# Altium schematic sheet Thermometer.SchDoc
size A4
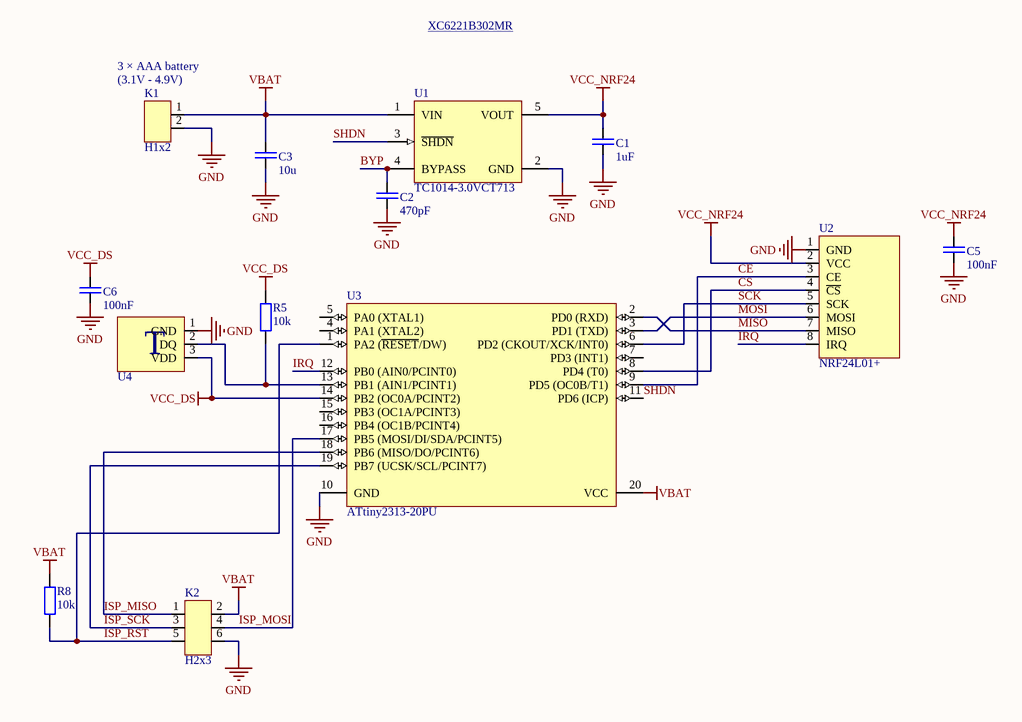
[diagram p0: Thermometer.SchDoc]

## Parts
C1  1uF  [C2012_0805I_M]
C2  470pF  [C2012_0805I_M]
C3  10u  [C3225_1210I_M]
C5  100nF  [C2012_0805I_M]
C6  100nF  [C2012_0805I_M]
K1  H1x2  [H1x2]
K2  H2x3  [H2x3]
R5  10k  [R2012_0805I_M]
R8  10k  [R2012_0805I_M]
U1  TC1014-3.0VCT713  [SOT-23-CT5_N]
U2  NRF24L01+  [NRF24L01+tht_module]
U3  ATtiny2313-20PU  [20P3]
U4  DS18B20  [TO92]  (value not drawn)

## Nets
GND: C1.2 C2.2 C3.2 C5.2 C6.2 K1.2 K2.6 U1.2(GND) U2.1(GND) U3.10(GND) U4.1(GND)
VBAT: C3.1 K1.1 K2.2 R8.1 U1.1(VIN) U3.20(VCC)
VCC_DS: C6.1 R5.1 U3.14(PB2_(OC0A/PCINT2)) U4.3(VDD)
VCC_NRF24: C1.1 C5.1 U1.5(VOUT) U2.2(VCC)
BYP: C2.1 U1.4(BYPASS)
CE: U2.3(CE) U3.9(PD5_(OC0B/T1))
CS: U2.4(~{CS}) U3.8(PD4_(T0))
IRQ: U2.8(IRQ) U3.12(PB0_(AIN0/PCINT0))
ISP_MISO: K2.1 U3.18(PB6_(MISO/DO/PCINT6))
ISP_MOSI: K2.4 U3.17(PB5_(MOSI/DI/SDA/PCINT5))
ISP_RST: K2.5 R8.2 U3.1(PA2_(~{RESET}/DW))
ISP_SCK: K2.3 U3.19(PB7_(UCSK/SCL/PCINT7))
MISO: U2.7(MISO) U3.2(PD0_(RXD))
MOSI: U2.6(MOSI) U3.3(PD1_(TXD))
SCK: U2.5(SCK) U3.6(PD2_(CKOUT/XCK/INT0))
SHDN: U1.3(~{SHDN}) U3.11(PD6_(ICP))
NetR5_2: R5.2 U3.13(PB1_(AIN1/PCINT1)) U4.2(DQ)

Not connected (* = marked no-connect by the designer): U3 4(PA1_(XTAL2)) 5(PA0_(XTAL1)) 7(PD3_(INT1)) 15(PB3_(OC1A/PCINT3)) 16(PB4_(OC1B/PCINT4))

## Notes on the sheet
- (near K1) 3 × AAA battery
- (near K1) (3.1V - 4.9V)
- XC6221B302MR <https://si.farnell.com/torex/xc6221b302mr/ldo-3-0v-high-speed-low-noise/dp/1454271>
- (in symbol DS18B20) T

## Library data of the parts
C1-C3 C5 C6 = C: Capacitor
K1 = H1x2: Header 1x2 (male)
K2 = H2x3: Header 2x3 (male)
R5 R8 = R
U1 = TC1014-3.0VCT713: 50 mA, 100 mA and 150 mA CMOS LDOs with Active-Low Shutdown and Reference Bypass, 5-Pin SOT-23, Extended Temperature, Tape and Reel; Manufacturer: Microchip; DatasheetVersion: revE, Feb-2007; PackageVersion: revBB, Aug-2009; PackageReference: SOT-23-CT5; PackageDescription: 5-Lead Plastic Small Outline Transistor (CT) [SOT-23]; Supplier 1: Digi-Key; Supplier Part Number 1: TC1014-3.0VCT713TR-ND; Supplier 2: Digi-Key; Supplier Part Number 2: TC1014-3.0VCT713CT-ND; Supplier 3: Digi-Key; Supplier Part Number 3: TC1014-3.0VCT713DKR-ND; Supplier 4: Farnell; Supplier Part Number 4: 1331501RL; Supplier 5: Farnell; Supplier Part Number 5: 1331501; Supplier 6: Newark; Supplier Part Number 6: 34M8761; Supplier 7: Mouser; Supplier Part Number 7: 579-TC1014-3.0VCT713; Mounting Technology: Surface Mount; Code_IPC: SOT23-5; PartNumber: TC1014-3.0VCT713; ComponentLink1Description: Manufacturer URL; ComponentLink1URL: http://www.microchip.com/; ComponentLink2Description: Datasheet; ComponentLink2URL: http://ww1.microchip.com/downloads/en/DeviceDoc/21335e.pdf; ComponentLink3Description: Package Specification; ComponentLink3URL: http://www.microchip.com/stellent/groups/techpub_sg/documents/packagingspec/en012702.pdf
U2 = NRF24L01+: 2.4GHz low power, long range module
U3 = ATtiny2313-20PU: Low Power tinyAVR® 8-Bit Microcontroller, 2.7-5.5V, 20MHz, 2K Flash Memory, Industrial Grade (-40°C to 85°C), 20-Lead PDIP, Pb-Free; DatasheetVersion: revL, Aug-2010; PackageVersion: revD, Oct-2010; PackageReference: 20P3; PackageDescription: 20-lead (0.300"/7.62mm Wide) Plastic Dual Inline Package (PDIP); Code_JEDEC: MS-001-AD; ComponentLink1Description: Manufacturer URL; ComponentLink1URL: http://www.atmel.com/; ComponentLink2Description: ATtiny2313 Datasheet; ComponentLink2URL: http://www.atmel.com/dyn/resources/prod_documents/doc2543.pdf; ComponentLink3Description: ATtiny2313 Summary; ComponentLink3URL: http://www.atmel.com/dyn/resources/prod_documents/doc2543S.pdf
U4 = DS18B20: Temperature sensor 1-wire interface